# Altium schematic sheet WienOscilator.SchDoc
size A4
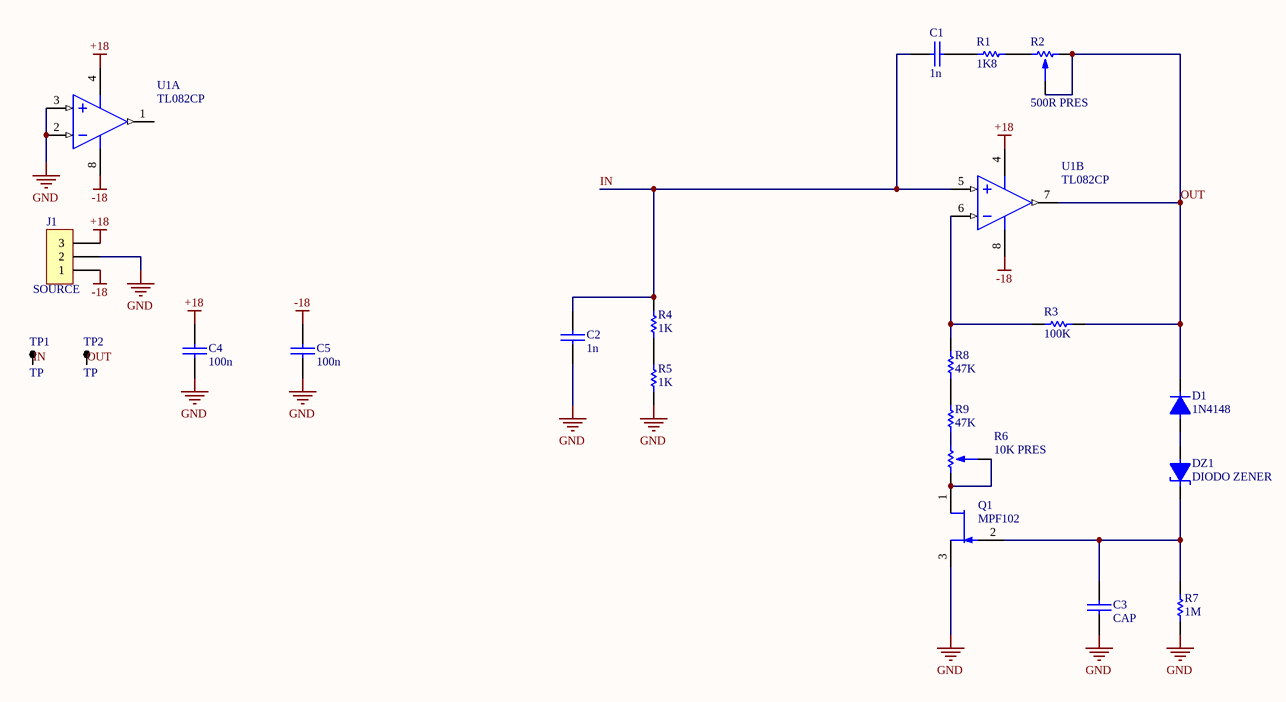
[diagram p0: WienOscilator.SchDoc]

## Parts
C1  1n  [CAP200]
C2  1n  [CAP200]
C3  CAP  [CAP200]
C4  100n  [CAP100]
C5  100n  [CAP100]
D1  1N4148  [DO41]
DZ1  DIODO ZENER  [DO41]
J1  SOURCE  [BORNERA3]
Q1  MPF102  [TO92]
R1  1K8  [0805]
R2  500R PRES  [PRESET V]
R3  100K  [0805]
R4  1K  [0805]
R5  1K  [0805]
R6  10K PRES  [PRESET V]
R7  1M  [0805]
R8  47K  [0805]
R9  47K  [0805]
TP1  TP  [TPTH]
TP2  TP  [TPTH]
U1  TL082CP  [N08E]  (parts A,B of 2)

## Nets
+18: C4.1 J1.3 U1.4(V-)
-18: C5.1 J1.1 U1.8(V+)
GND: C2.1 C3.2 C4.2 C5.2 J1.2 Q1.3(S) R5.2 R7.1 U1.2(INA-) U1.3(INA+)
IN: C1.1 C2.2 R4.1 TP1.1 U1.5(INB+)
OUT: D1.2 R2.1 R2.2 R3.1 TP2.1 U1.7(OUTB)
NetC1_2: C1.2 R1.2
NetC3_1: C3.1 DZ1.2 Q1.2(G) R7.2
NetD1_1: D1.1 DZ1.1
NetQ1_1: Q1.1(D) R6.2 R6.3
NetR1_1: R1.1 R2.3
NetR3_2: R3.2 R8.2 U1.6(INB-)
NetR4_2: R4.2 R5.1
NetR6_1: R6.1 R9.1
NetR8_1: R8.1 R9.2

Not connected (* = marked no-connect by the designer): U1 1(OUTA)

## Library data of the parts
C1 C2 C4 C5 = CAP
D1 = DIODO
J1 = BORNERA 3
Q1 = JFET-N: N-Channel JFET; Published: 8-Jun-2000; LatestRevisionDate: 17-Jul-2002; LatestRevisionNote: Re-released for DXP Platform.; PackageReference: TO-254-AA; Publisher: Altium Limited; Code_JEDEC: TO-254-AA
R1 R3-R5 R7-R9 = RES
R2 R6 = PRESET
U1 = TL082CP: Wide Bandwidth Dual JFET Input Operational Amplifier, 8-pin MDIP; Manufacturer: National Semiconductor; PackageTopMarking: NSUZXYTTE#*TL082*CP; PowerWise: N; CompType: Amplifiers; Published: 4-Dec-2008; LatestRevisionDate: 13-Jan-2009; LatestRevisionNote: Sim Model Added.; DatasheetVersion: Aug-2000; PackageVersion: revG, May-2006; PackageReference: N08E; Publisher: Altium Limited; PackageDescription: MDIP, .365 x .250 x .130in, 8 Lead, .100in Pitch; PartNumber: TL082CP; RoHS: N; PinCount: 8; Code_JEDEC: MS-001-BA; ComponentLink1Description: TL082 Datasheet; ComponentLink1URL: http://www.national.com/ds/TL/TL082.pdf; ComponentLink2Description: TL082 Web Page; ComponentLink2URL: http://www.national.com/pf/TL/TL082.html; ComponentLink3Description: N08E Package Page; ComponentLink3URL: http://www.national.com/packaging/folders/n08e.html